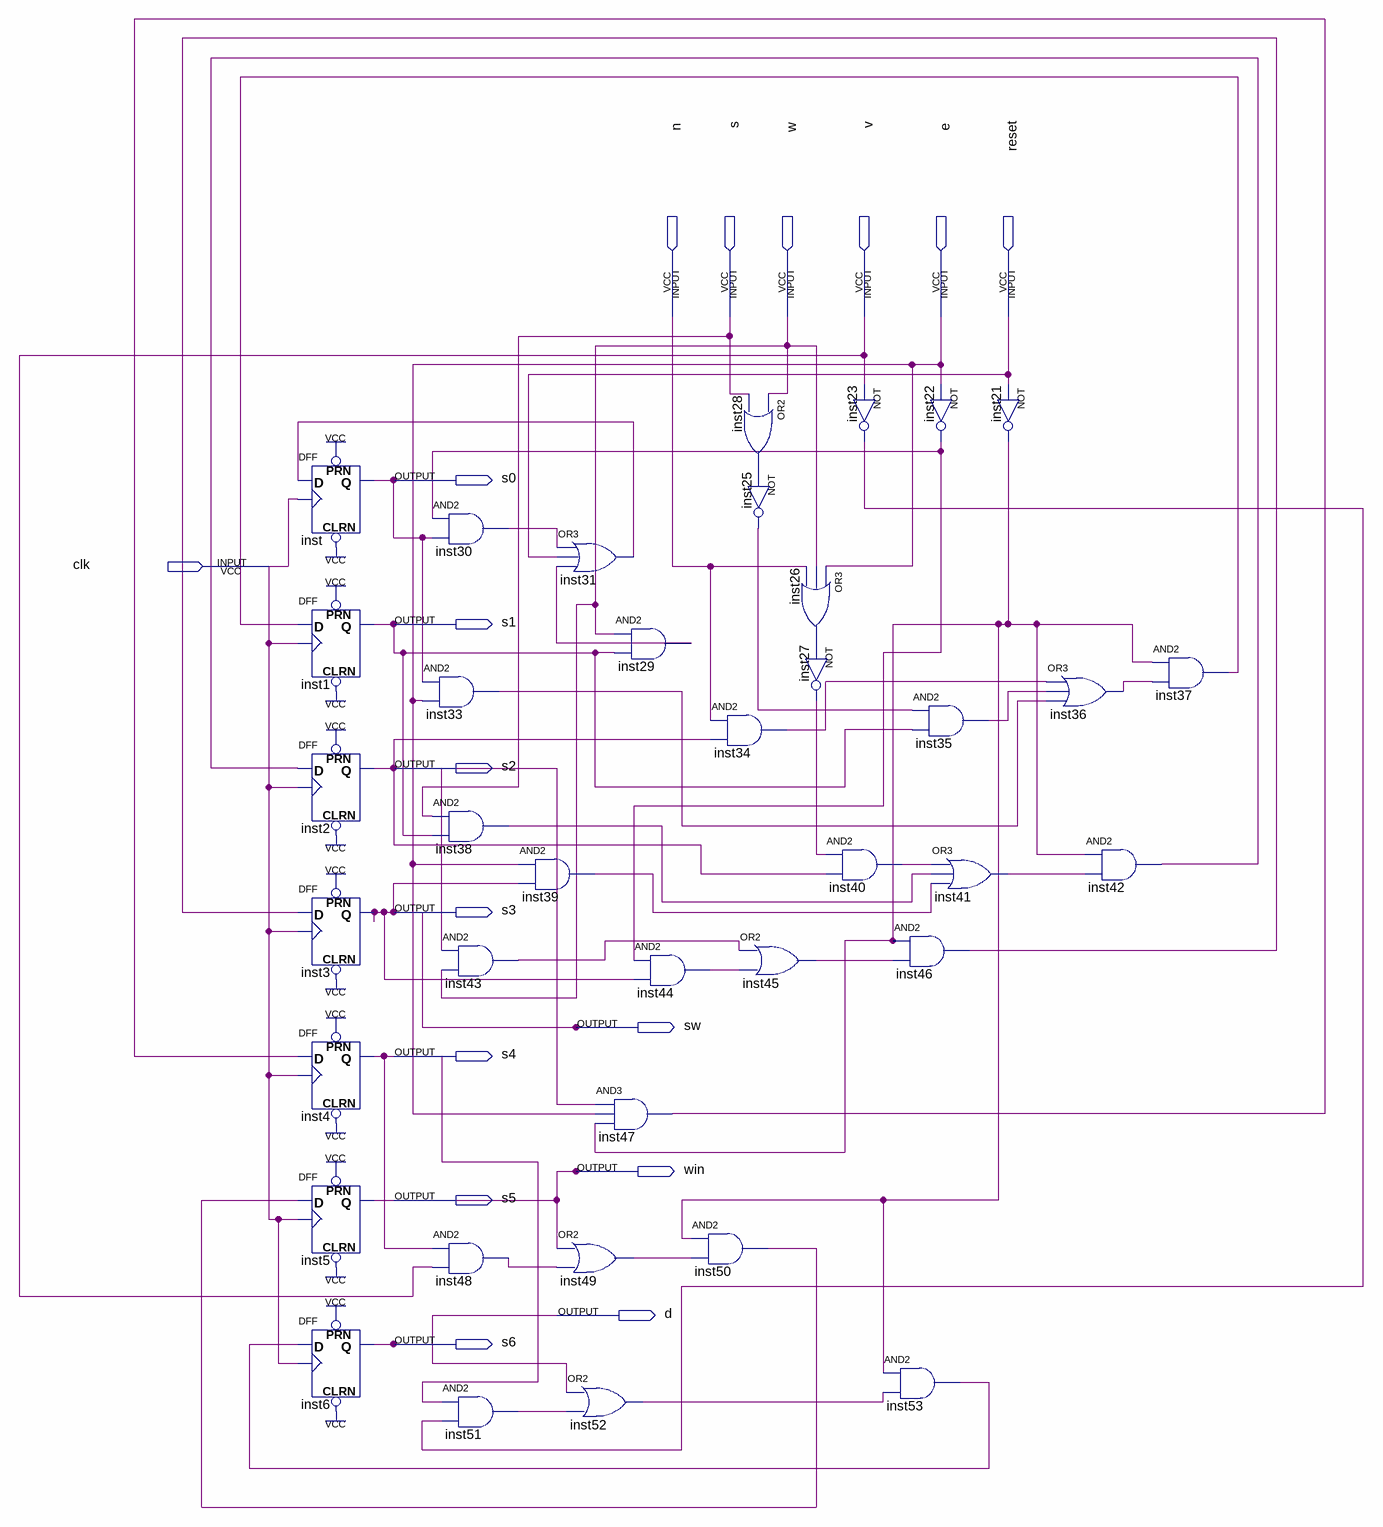
[diagram p0: schematic sheet]
// Quartus schematic room.bdf as structural Verilog: 38 symbols, 17 pins
module room (
  input  n,
  input  s,
  input  w,
  input  v,
  input  e,
  input  reset,
  input  clk,
  output s0,
  output s1,
  output s2,
  output s3,
  output sw,
  output s4,
  output win,
  output s5,
  output d,
  output s6
);

  wire inst21_out, inst22_out, inst23_out, inst25_out, inst26_out, inst27_out, inst28_out, inst29_out,
       inst30_out, inst31_out, inst33_out, inst34_out, inst35_out, inst36_out, inst37_out, inst38_out,
       inst39_out, inst40_out, inst41_out, inst42_out, inst43_out, inst44_out, inst45_out, inst46_out,
       inst47_out, inst48_out, inst49_out, inst50_out, inst51_out, inst52_out, inst53_out, undriven,
       undriven_2, undriven_3;

  DFF inst (.CLRN(1'b1), .CLK(clk), .D(inst31_out), .PRN(1'b1), .Q(s0));
  DFF inst1 (.CLRN(1'b1), .CLK(clk), .D(inst37_out), .PRN(1'b1), .Q(s1));
  DFF inst2 (.CLRN(1'b1), .CLK(clk), .D(inst42_out), .PRN(1'b1), .Q(s2));
  DFF inst3 (.CLRN(1'b1), .CLK(clk), .D(inst46_out), .PRN(1'b1), .Q(s3));
  DFF inst4 (.CLRN(1'b1), .CLK(clk), .D(inst47_out), .PRN(1'b1), .Q(s4));
  DFF inst5 (.CLRN(1'b1), .CLK(clk), .D(inst50_out), .PRN(1'b1), .Q(s5));
  DFF inst6 (.CLRN(1'b1), .CLK(clk), .D(inst53_out), .PRN(1'b1), .Q(s6));
  and inst30 (inst30_out, inst22_out, s0);
  and inst33 (inst33_out, s0, e);
  and inst38 (inst38_out, s, s1);
  and inst43 (inst43_out, undriven_3, w);
  and inst48 (inst48_out, s4, v);
  and inst51 (inst51_out, undriven_2, inst23_out);
  or inst31 (inst31_out, inst30_out, reset, inst29_out);
  and inst39 (inst39_out, e, s3);
  or inst49 (inst49_out, win, inst48_out);
  or inst52 (inst52_out, d, inst51_out);
  and inst29 (inst29_out, w, s1);
  and inst44 (inst44_out, inst22_out, s3);
  and inst47 (inst47_out, undriven, e, inst21_out);
  and inst34 (inst34_out, n, s2);
  and inst50 (inst50_out, inst21_out, inst49_out);
  or inst28 (inst28_out, w, s);
  not inst25 (inst25_out, inst28_out);
  or inst26 (inst26_out, e, w, n);
  not inst27 (inst27_out, inst26_out);
  or inst45 (inst45_out, inst43_out, inst44_out);
  not inst23 (inst23_out, v);
  and inst40 (inst40_out, inst27_out, s2);
  not inst22 (inst22_out, e);
  and inst35 (inst35_out, inst25_out, s1);
  or inst41 (inst41_out, inst40_out, inst38_out, inst39_out);
  and inst46 (inst46_out, inst21_out, inst45_out);
  and inst53 (inst53_out, inst21_out, inst52_out);
  not inst21 (inst21_out, reset);
  or inst36 (inst36_out, inst34_out, inst35_out, inst33_out);
  and inst42 (inst42_out, inst21_out, inst41_out);
  and inst37 (inst37_out, inst21_out, inst36_out);
endmodule
